# Altium schematic sheet STM32.SchDoc: USB-RTD Reader
size A4; Revision: 1.0; SheetNumber: 2; SheetTotal: 3
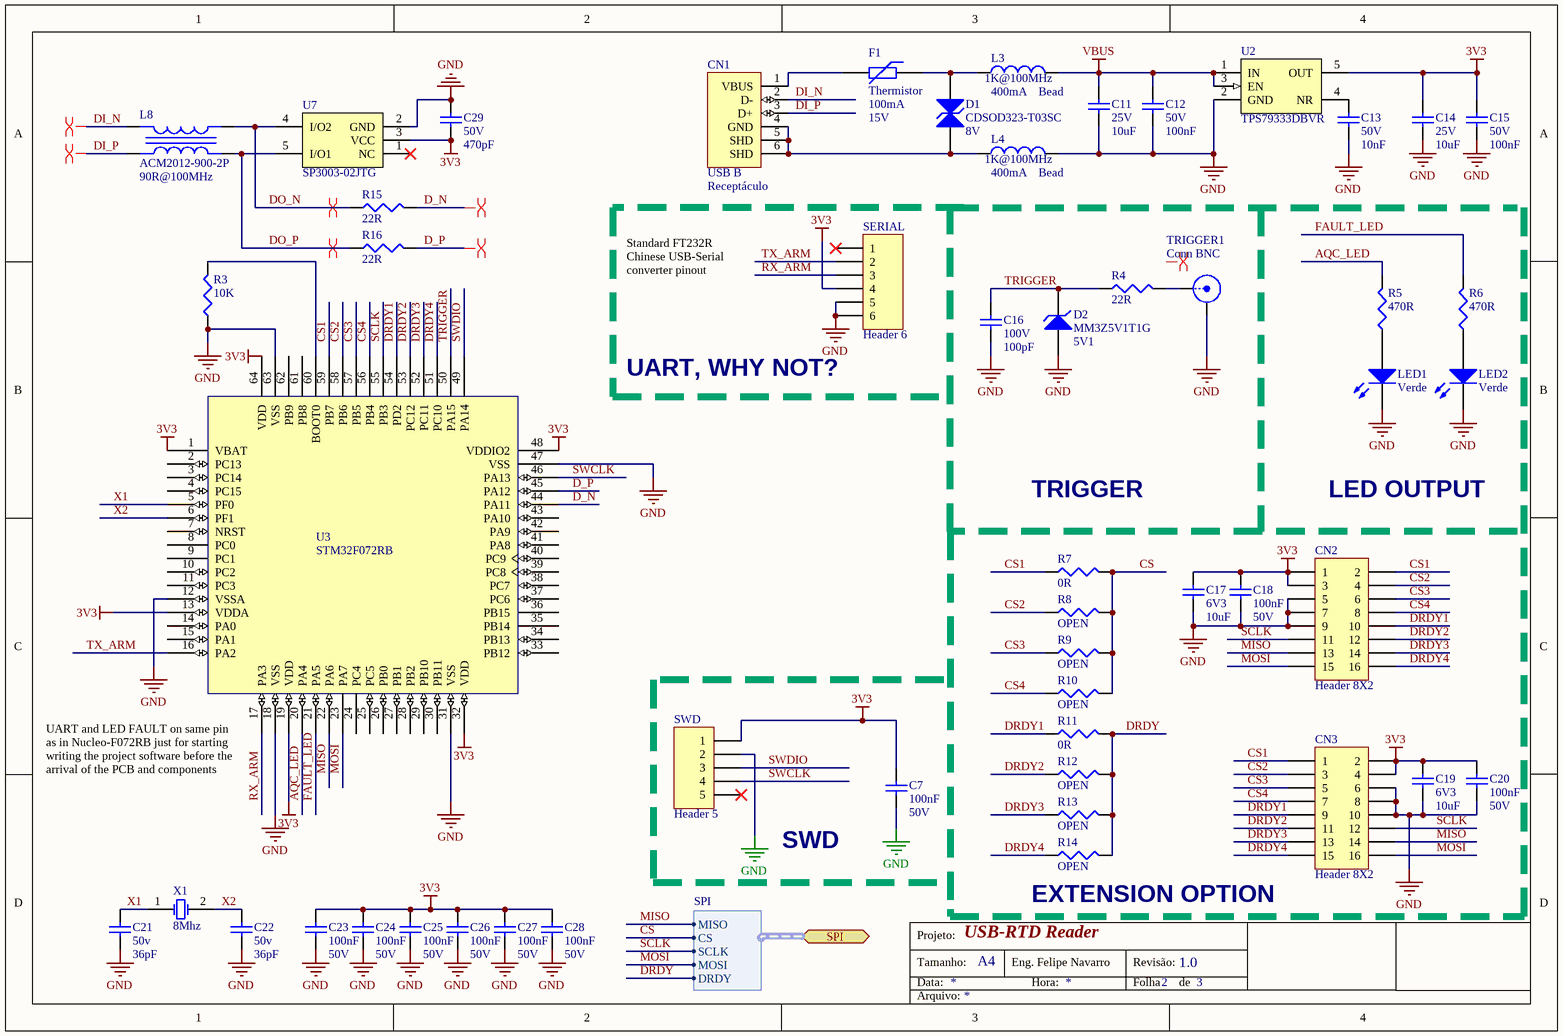
[diagram p0: STM32.SchDoc]

## Parts
C7  value 100nF  Tensão: 50V  [CC0603]  (hidden comment: Capacitor Cerâmico)
C11  value 10uF  Tensão: 25V  [CC0805]  (hidden comment: Capacitor Cerâmico)
C12  value 100nF  Tensão: 50V  [CC0603]  (hidden comment: Capacitor Cerâmico)
C13  value 10nF  Tensão: 50V  [CC0603]  (hidden comment: Capacitor Cerâmico)
C14  value 10uF  Tensão: 25V  [CC0805]  (hidden comment: Capacitor Cerâmico)
C15  value 100nF  Tensão: 50V  [CC0603]  (hidden comment: Capacitor Cerâmico)
C16  value 100pF  Tensão: 100V  [CC0603]  (hidden comment: Capacitor Cerâmico)
C17  value 10uF  Tensão: 6V3  [CC0805]  (hidden comment: Capacitor Cerâmico)
C18  value 100nF  Tensão: 50V  [CC0603]  (hidden comment: Capacitor Cerâmico)
C19  value 10uF  Tensão: 6V3  [CC0805]  (hidden comment: Capacitor Cerâmico)
C20  value 100nF  Tensão: 50V  [CC0603]  (hidden comment: Capacitor Cerâmico)
C21  value 36pF  Tensão: 50v  [CC0603]  (hidden comment: Capacitor Cerâmico)
C22  value 36pF  Tensão: 50v  [CC0603]  (hidden comment: Capacitor Cerâmico)
C23  value 100nF  Tensão: 50V  [CC0603]  (hidden comment: Capacitor Cerâmico)
C24  value 100nF  Tensão: 50V  [CC0603]  (hidden comment: Capacitor Cerâmico)
C25  value 100nF  Tensão: 50V  [CC0603]  (hidden comment: Capacitor Cerâmico)
C26  value 100nF  Tensão: 50V  [CC0603]  (hidden comment: Capacitor Cerâmico)
C27  value 100nF  Tensão: 50V  [CC0603]  (hidden comment: Capacitor Cerâmico)
C28  value 100nF  Tensão: 50V  [CC0603]  (hidden comment: Capacitor Cerâmico)
C29  value 470pF  Tensão: 50V  [CC0603]  (hidden comment: Capacitor Cerâmico)
CN1  USB B  value Receptáculo  [CONN_USB-B_RCPT-H]
CN2  Header 8X2  [CONN HDR2X8]
CN3  Header 8X2  [CONN HDR2X8]
D1  CDSOD323-T03SC  Tensão: 8V  [SOD-323 BIDIRECT]
D2  MM3Z5V1T1G  Tensão: 5V1  [SOD-323 Diodo-K2]
F1  Thermistor  Corrente: 100mA  Tensão: 15V  [CC0805]
L3  Bead  value 1K@100MHz  Corrente: 400mA  [CC0603]
L4  Bead  value 1K@100MHz  Corrente: 400mA  [CC0603]
L8  ACM2012-900-2P  value 90R@100MHz  [TR0805-4N]
LED1  value Verde  [LED-INDIC]  (hidden comment: LED)
LED2  value Verde  [LED-INDIC]  (hidden comment: LED)
R3  value 10K  [CC0603]  (hidden comment: Resistor)
R4  value 22R  [CC0603]  (hidden comment: Resistor)
R5  value 470R  [CC0603]  (hidden comment: Resistor)
R6  value 470R  [CC0603]  (hidden comment: Resistor)
R7  value 0R  [CC0603]  (hidden comment: Resistor)
R8  value OPEN  [CC0603]  (hidden comment: Resistor Open)  (no BOM)
R9  value OPEN  [CC0603]  (hidden comment: Resistor Open)  (no BOM)
R10  value OPEN  [CC0603]  (hidden comment: Resistor Open)  (no BOM)
R11  value 0R  [CC0603]  (hidden comment: Resistor)
R12  value OPEN  [CC0603]  (hidden comment: Resistor Open)  (no BOM)
R13  value OPEN  [CC0603]  (hidden comment: Resistor Open)  (no BOM)
R14  value OPEN  [CC0603]  (hidden comment: Resistor Open)  (no BOM)
R15  value 22R  [CC0603]  (hidden comment: Resistor)
R16  value 22R  [CC0603]  (hidden comment: Resistor)
SERIAL  Header 6  [CONN HDR1X6]
SWD  Header 5  [CONN HDR1X5]
TRIGGER1  Conn BNC  [CONN BNC-JACK]
U2  TPS79333DBVR  [SOT-23-5N]
U3  STM32F072RB  [TQFP-64N]
U7  SP3003-02JTG  [SC70-5N]
X1  8Mhz  [HC/49US]

## Ports
SPI (harness SPI)

## Harnesses
SPI: MISO, CS, SCLK, MOSI, DRDY

## Nets
3V3: C7.2 C14.2 C15.2 C17.2 C18.2 C19.2 C20.2 C23.2 C24.2 C25.2 C26.2 C27.2 C28.2 C29.1 CN2.1 CN2.3 CN3.2 CN3.4 SERIAL.4 SWD.1 U2.5(OUT) U3.1(VBAT) U3.13(VDDA) U3.19(VDD) U3.32(VDD) U3.48(VDDIO2) U3.64(VDD) U7.3(VCC)
GND: C7.1 C11.1 C12.1 C13.1 C14.1 C15.1 C16.1 C17.1 C18.1 C19.1 C20.1 C21.1 C22.1 C23.1 C24.1 C25.1 C26.1 C27.1 C28.1 C29.2 CN2.5 CN2.7 CN2.9 CN3.6 CN3.8 CN3.10 D2.1(A) L4.2 LED1.2(K) LED2.2(K) R3.1 SERIAL.5 SERIAL.6 SWD.2 TRIGGER1.2(Y) U2.2(GND) U3.12(VSSA) U3.18(VSS) U3.31(VSS) U3.47(VSS) U3.63(VSS) U7.2(GND)
VBUS: C11.2 C12.2 L3.2 U2.1(IN) U2.3(EN)
AQC_LED: R5.2 U3.20(PA4)
CS: R7.2 R8.2 R9.2 R10.2 ; port SPI.CS
CS1: CN2.2 CN3.1 R7.1 U3.59(PB7)
CS2: CN2.4 CN3.3 R8.1 U3.58(PB6)
CS3: CN2.6 CN3.5 R9.1 U3.57(PB5)
CS4: CN2.8 CN3.7 R10.1 U3.56(PB4)
D_N: R15.2 U3.44(PA11)
D_P: R16.2 U3.45(PA12)
DI_N: CN1.2(D-) L8.3(Sec+)
DI_P: CN1.3(D+) L8.4(Sec-)
DO_N: L8.2(Pri-) R15.1 U7.4(I/O2)
DO_P: L8.1(Pri+) R16.1 U7.5(I/O1)
DRDY: R11.2 R12.2 R13.2 R14.2 ; port SPI.DRDY
DRDY1: CN2.10 CN3.9 R11.1 U3.54(PD2)
DRDY2: CN2.12 CN3.11 R12.1 U3.53(PC12)
DRDY3: CN2.14 CN3.13 R13.1 U3.52(PC11)
DRDY4: CN2.16 CN3.15 R14.1 U3.51(PC10)
FAULT_LED: R6.2 U3.21(PA5)
MISO: CN2.13 CN3.14 U3.22(PA6) ; port SPI.MISO
MOSI: CN2.15 CN3.16 U3.23(PA7) ; port SPI.MOSI
RX_ARM: SERIAL.3 U3.17(PA3)
SCLK: CN2.11 CN3.12 U3.55(PB3) ; port SPI.SCLK
SWCLK: SWD.4 U3.46(PA13)
SWDIO: SWD.3 U3.49(PA14)
TRIGGER: C16.2 D2.2(K) R4.1 U3.50(PA15)
TX_ARM: SERIAL.2 U3.16(PA2)
X1: C21.2 U3.5(PF0) X1.1(OSC1)
X2: C22.2 U3.6(PF1) X1.2(OSC2)
NetC13_2: C13.2 U2.4(NR)
NetCN1_1: CN1.1(VBUS) F1.2
NetCN1_4: CN1.4(GND) CN1.5(SHD) CN1.6(SHD) D1.1(A) L4.1
NetD1_2: D1.2(K) F1.1 L3.1
NetLED1_1: LED1.1(A) R5.1
NetLED2_1: LED2.1(A) R6.1
NetR3_2: R3.2 U3.60(BOOT0)
NetR4_2: R4.2 TRIGGER1.1(X)

Not connected (* = marked no-connect by the designer): SERIAL 1*; SWD 5*; U3 2(PC13) 3(PC14) 4(PC15) 7(NRST) 8(PC0) 9(PC1) 10(PC2) 11(PC3) 14(PA0) 15(PA1) 24(PC4) 25(PC5) 26(PB0) 27(PB1) 28(PB2) 29(PB10) 30(PB11) 33(PB12) 34(PB13) 35(PB14) 36(PB15) 37(PC6) 38(PC7) 39(PC8) 40(PC9) 41(PA8) 42(PA9) 43(PA10) 61(PB8) 62(PB9); U7 1(NC)*

## Layout directives
differential pair: (no net found under the mark), D_N, D_P, DI_N, DI_P, DO_N, DO_P

## Notes on the sheet
- Standard FT232R Chinese USB-Serial converter pinout
- UART, WHY NOT?
- TRIGGER
- LED OUTPUT
- (near U3) UART and LED FAULT on same pin as in Nucleo-F072RB just for starting writing the project software before the arrival of the PCB and components
- SWD
- (near R14) EXTENSION OPTION
- Projeto:
- Tamanho:
- Data:
- A4
- Eng. Felipe Navarro
- Hora:
- Revisão:
- Folha
- de
- Arquivo:

## Library data of the parts
C7 C18 C20 C23-C28 = Cap 100nF 50V 0603 X7R: Capacitor (Semiconductor SIM Model); ChinesePrice: 0,00000; Chinês: -----; Corrente: *A; Potência: *W; Obs:: X7R; Tolerância: ±10%; Supplier 1: Digi-Key; Supplier Part Number 1: 1276-1000-1-ND; ComponentLink1Description: Datasheet; ComponentLink1URL: D:\Tecnoclade\Datasheet\!DataMissing.pdf
C11 C14 = Cap 10uF 25V 0805 X5R: Capacitor (Semiconductor SIM Model); Chinês: Local; ChinesePrice: 0,02620; Corrente: *A; Potência: *W; Obs:: X5R; Tolerância: ±10%; Supplier 1: Digi-Key; Supplier Part Number 1: 587-2985-1-ND; ComponentLink1Description: Datasheet; ComponentLink1URL: D:\Tecnoclade\Datasheet\!DataMissing.pdf
C12 C15 = Cap 100nF 50V 0603 X7R: Capacitor (Semiconductor SIM Model); Chinês: Local; ChinesePrice: 0,00250; Corrente: *A; Potência: *W; Obs:: X7R; Tolerância: ±10%; Supplier 1: Digi-Key; Supplier Part Number 1: 1276-1000-1-ND; ComponentLink1Description: Datasheet; ComponentLink1URL: D:\Tecnoclade\Datasheet\!DataMissing.pdf
C13 = Cap 10nF 50V 0603 X7R 5%: Capacitor (Semiconductor SIM Model); Chinês: Local; ChinesePrice: 0,00320; Corrente: *A; Potência: *W; Obs:: X7R; Tolerância: ±5%; Supplier 1: Digi-Key; Supplier Part Number 1: 399-1092-1-ND; ComponentLink1Description: Datasheet; ComponentLink1URL: D:\Tecnoclade\Datasheet\!DataMissing.pdf
C16 = Cap 100pF 100V 0603 NP0: Capacitor (Semiconductor SIM Model); Chinês: -----; ChinesePrice: 0,00000; Corrente: *A; Potência: *W; Obs:: NP0; Tolerância: ±5%; Supplier 1: Digi-Key; Supplier Part Number 1: 1276-1295-1-ND; ComponentLink1Description: Datasheet; ComponentLink1URL: D:\Tecnoclade\Datasheet\!DataMissing.pdf
C17 C19 = Cap 10uF 6V3 0805 Y5V: Capacitor (Semiconductor SIM Model); Chinês: Local; ChinesePrice: 0,01200; Corrente: *A; Potência: *W; Obs:: Y5V; Tolerância: -20%, +80%; Supplier 1: Digi-Key; Supplier Part Number 1: 587-1314-1-ND; ComponentLink1Description: Datasheet; ComponentLink1URL: D:\Tecnoclade\Datasheet\!DataMissing.pdf
C21 C22 = Cap - $Val $V $Footprint $Classe_1: Capacitor (Semiconductor SIM Model); Chinês: ----; ChinesePrice: 0,00000; Corrente: *A; Potência: *W; Tolerância: ±*%; Supplier 1: Digi-Key; Supplier Part Number 1: 1276-1187-1-ND; Obs:: *; ComponentLink1Description: Datasheet; ComponentLink1URL: D:\Tecnoclade\Datasheet\!DataMissing.pdf
C29 = Cap 470pF 50V 0603 X7R: Capacitor (Semiconductor SIM Model); Chinês: Local; ChinesePrice: 0,00180; Corrente: *A; Potência: *W; Obs:: X7R; Tolerância: ±10%; Supplier 1: Digi-Key; Supplier Part Number 1: 399-1075-1-ND; ComponentLink1Description: Datasheet; ComponentLink1URL: D:\Tecnoclade\Datasheet\!DataMissing.pdf
CN1 = USB B RCPT-H: Conector Jack USB B, Through Hole, Right Angle, Horizontal; ChinesePrice: 0,00000; Chinês: ----; Obs:: USB 2.0; Corrente: *; Potência: *; Supplier 1: Digi-Key; Supplier Part Number 1: A31725-ND; Tensão: *; Tolerância: *; ComponentLink1Description: Datasheet; ComponentLink1URL: D:\Tecnoclade\Datasheet\!DataMissing.pdf
CN2 = Header 8X2: Header, 8-Pin, Dual row; ChinesePrice: 0,10000; Chinês: ----; Corrente: *; Potência: *; Supplier 1: Digi-Key; Supplier Part Number 1: 609-3337-ND; Tensão: *; Obs:: *; Tolerância: *; ComponentLink1Description: Datasheet; ComponentLink1URL: D:\Tecnoclade\Datasheet\!DataMissing.pdf
CN3 = Header 8X2: Header, 8-Pin, Dual row; ChinesePrice: 0,10000; Chinês: ----; Value: Barra dupla de pinos; Corrente: *; Potência: *; Supplier 1: Digi-Key; Supplier Part Number 1: PPPC082LJBN-RC; Tensão: *; Obs:: *; Tolerância: *; ComponentLink1Description: Datasheet; ComponentLink1URL: D:\Tecnoclade\Datasheet\!DataMissing.pdf
D1 = TVS 8V 5% SOD323 BI 400W: Transient Voltage Supressor diode; ChinesePrice: 0,00000; Chinês: ----; Corrente: 43A; Potência: 400W; Value: 200pF@1MHz; Obs:: Bidirecional; Tolerância: ±*%; Supplier 1: Digi-Key; Supplier Part Number 1: CDSOD323-T03SCCT-ND; ComponentLink1Description: Datasheet; ComponentLink1URL: D:\Tecnoclade\Datasheet\!DataMissing.pdf
D2 = DZ 5V1 200mW SOD-323: Zener Diode; ChinesePrice: 0,00000; Chinês: ----; Potência: 200mW; Value: Z=60R; Obs:: 900mV @ 10mA; Tolerância: ±6%; Corrente: *; Supplier 1: Digi-Key; Supplier Part Number 1: MM3Z5V1T1GOSCT-ND; ComponentLink1Description: Datasheet; ComponentLink1URL: D:\Tecnoclade\Datasheet\!DataMissing.pdf
F1 = Res Varistor: Varistor (Voltage-Sensitive Resistor); ChinesePrice: 0,09500; Chinês: Local; Obs: TRIP: 300mA; Supplier 1: Digi-Key; Supplier Part Number 1: 507-1810-1-ND; ComponentLink1Description: Datasheet; ComponentLink1URL: D:\Tecnoclade\Datasheet\!DataMissing.pdf
L3 L4 = Bd 1K@100MHz 0603 400mA: ChinesePrice: 0,00000; Chinês: -----; Obs:: Ferrite (0R5); Tolerância: ±25%; Potência: *; Supplier 1: Digi-Key; Supplier Part Number 1: 445-1550-1-ND; Tensão: *; ComponentLink1Description: Datasheet; ComponentLink1URL: D:\Tecnoclade\Datasheet\!DataMissing.pdf; Substituição: 27/06/2014
L8 = ACM2012-900-2P: Indutor de Modo Comum; Corrente: 400mA; ChinesePrice: 0,19100; Chinês: Local; Potência: *W; Tensão: *V; Tolerância: ±*%; Obs:: Z=0R19; Supplier Part Number 1: 445-2207-1-ND; Supplier 1: Digi-Key; ComponentLink1Description: Datasheet; ComponentLink1URL: D:\Tecnoclade\Datasheet\!DataMissing.pdf; Substituição: 00/00/0000
LED1 LED2 = LED2: Typical RED, GREEN, YELLOW, AMBER GaAs LED; ChinesePrice: 0,00000; Chinês: ----; VertSimCode: } XXXXX {; Supplier 1: Digi-Key; Supplier Part Number 1: 754-1297-ND
R3 = Res 10K 1% 0603 1/10W: ChinesePrice: 0,00089; Chinês: Local; Corrente: *A; Potência: 1/10W; Tensão: *V; Tolerância: ±1%; Supplier 1: Digi-Key; Supplier Part Number 1: P10.0KHCT-ND; Obs: *; ComponentLink1Description: Datasheet; ComponentLink1URL: D:\Tecnoclade\Datasheet\!DataMissing.pdf
R4 R15 R16 = Res 22R 1% 0603 1/10W: ChinesePrice: 0,00000; Chinês: ----; Corrente: *A; Potência: 1/10W; Tensão: *V; Obs: ±100ppm/ºC; Tolerância: ±1%; Supplier 1: Digi-Key; Supplier Part Number 1: RMCF0603FT22R0CT-ND; ComponentLink1Description: Datasheet; ComponentLink1URL: D:\Tecnoclade\Datasheet\!DataMissing.pdf
R5 R6 = Res 470R 5% 0603 1/10W: ChinesePrice: 0,00000; Chinês: ----; Corrente: *A; Potência: 1/10W; Tensão: *V; Obs: ±200ppm/ºC; Tolerância: ±5%; Supplier 1: Digi-Key; Supplier Part Number 1: RMCF0603JT470RCT-ND; ComponentLink1Description: Datasheet; ComponentLink1URL: D:\Tecnoclade\Datasheet\!DataMissing.pdf
R7 R11 = Res 0R 0603 1/10W: ChinesePrice: 0,00089; Chinês: Local; Corrente: *A; Potência: 1/10W; Tensão: *V; Tolerância: Jumper; Supplier 1: Digi-Key; Supplier Part Number 1: P0.0GCT-ND; Obs: *; ComponentLink1Description: Datasheet; ComponentLink1URL: D:\Tecnoclade\Datasheet\!DataMissing.pdf
R8-R10 R12-R14 = Res Open 0603: Resistor; ChinesePrice: 0,00000; Chinês: ----; Corrente: *A; Potência: *W; Tensão: *V; Tolerância: ±*%; Supplier 1: Digi-Key; Supplier Part Number 1: --Del; Obs:: *; ComponentLink1Description: Datasheet; ComponentLink1URL: D:\Tecnoclade\Datasheet\!DataMissing.pdf
SERIAL = Header 6: Header, 6-Pin; ChinesePrice: 0,10000; Chinês: Proved - Local; Value: Barra de 40 pinos - ATENÇÃO; Corrente: *; Potência: *; Supplier 1: Digi-Key; Supplier Part Number 1: A26509-40-ND; Tensão: *; Obs:: *; Tolerância: *; ComponentLink1Description: Datasheet; ComponentLink1URL: D:\Tecnoclade\Datasheet\!DataMissing.pdf
SWD = Header 5: Header, 5-Pin; ChinesePrice: 0,10000; Chinês: Proved - Local; Value: Barra de 40 pinos - ATENÇÃO; Corrente: *; Potência: *; Supplier 1: Digi-Key; Supplier Part Number 1: A26509-40-ND; Tensão: *; Obs:: *; Tolerância: *; ComponentLink1Description: Datasheet; ComponentLink1URL: D:\Tecnoclade\Datasheet\!DataMissing.pdf
TRIGGER1 = Conn BNC: Conector BNC; ChinesePrice: 0,00000; Chinês: ----; Value: Jack BNC; Corrente: *; Potência: *; Supplier 1: Digi-Key; Supplier Part Number 1: A97569-ND; Tensão: *; Obs:: *; Tolerância: *; ComponentLink1Description: Datasheet; ComponentLink1URL: D:\Tecnoclade\Datasheet\!DataMissing.pdf
U2 = TPS79333: ULTRALOW-NOISE, HIGH PSRR, FAST RF 200mA LOW-DROPOUT LINEAR  REGULATORS I; Tensão: 3V3; ChinesePrice: 0,00000; Chinês: ----; Corrente: 200mA; Potência: *; Supplier 1: Digi-Key; Supplier Part Number 1: 296-12961-1-ND; Value: *; Obs:: *; Tolerância: *; ComponentLink1Description: Datasheet; ComponentLink1URL: D:\Tecnoclade\Datasheet\
U3 = STM32F072RB: ARM Cortex M3; ChinesePrice: 0,00000; Chinês: ----; Potência: *; Supplier 1: Digi-Key; Supplier Part Number 1: 497-14644-ND; Tensão: *; Obs:: *; Tolerância: *; ComponentLink1Description: Datasheet; ComponentLink1URL: D:\Tecnoclade\Datasheet\
U7 = SP3003-02JTG: TVS DIODE ARRAY; Value: 0.65pF; Tensão: 6V; Supplier Part Number 1: F3301CT-ND; Supplier 1: Digi-Key
X1 = XTAL: Crystal Oscillator; ChinesePrice: 0,00000; Chinês: ----; Value: 20pF/40R; Corrente: *; Potência: *; Supplier 1: Digi-Key; Supplier Part Number 1: 535-10212-1-ND; Tensão: *; Obs:: *; Tolerância: *